# Altium schematic sheet Comparator.SchDoc
size 209 x 297 mm; SheetNumber: 3; SheetTotal: 4
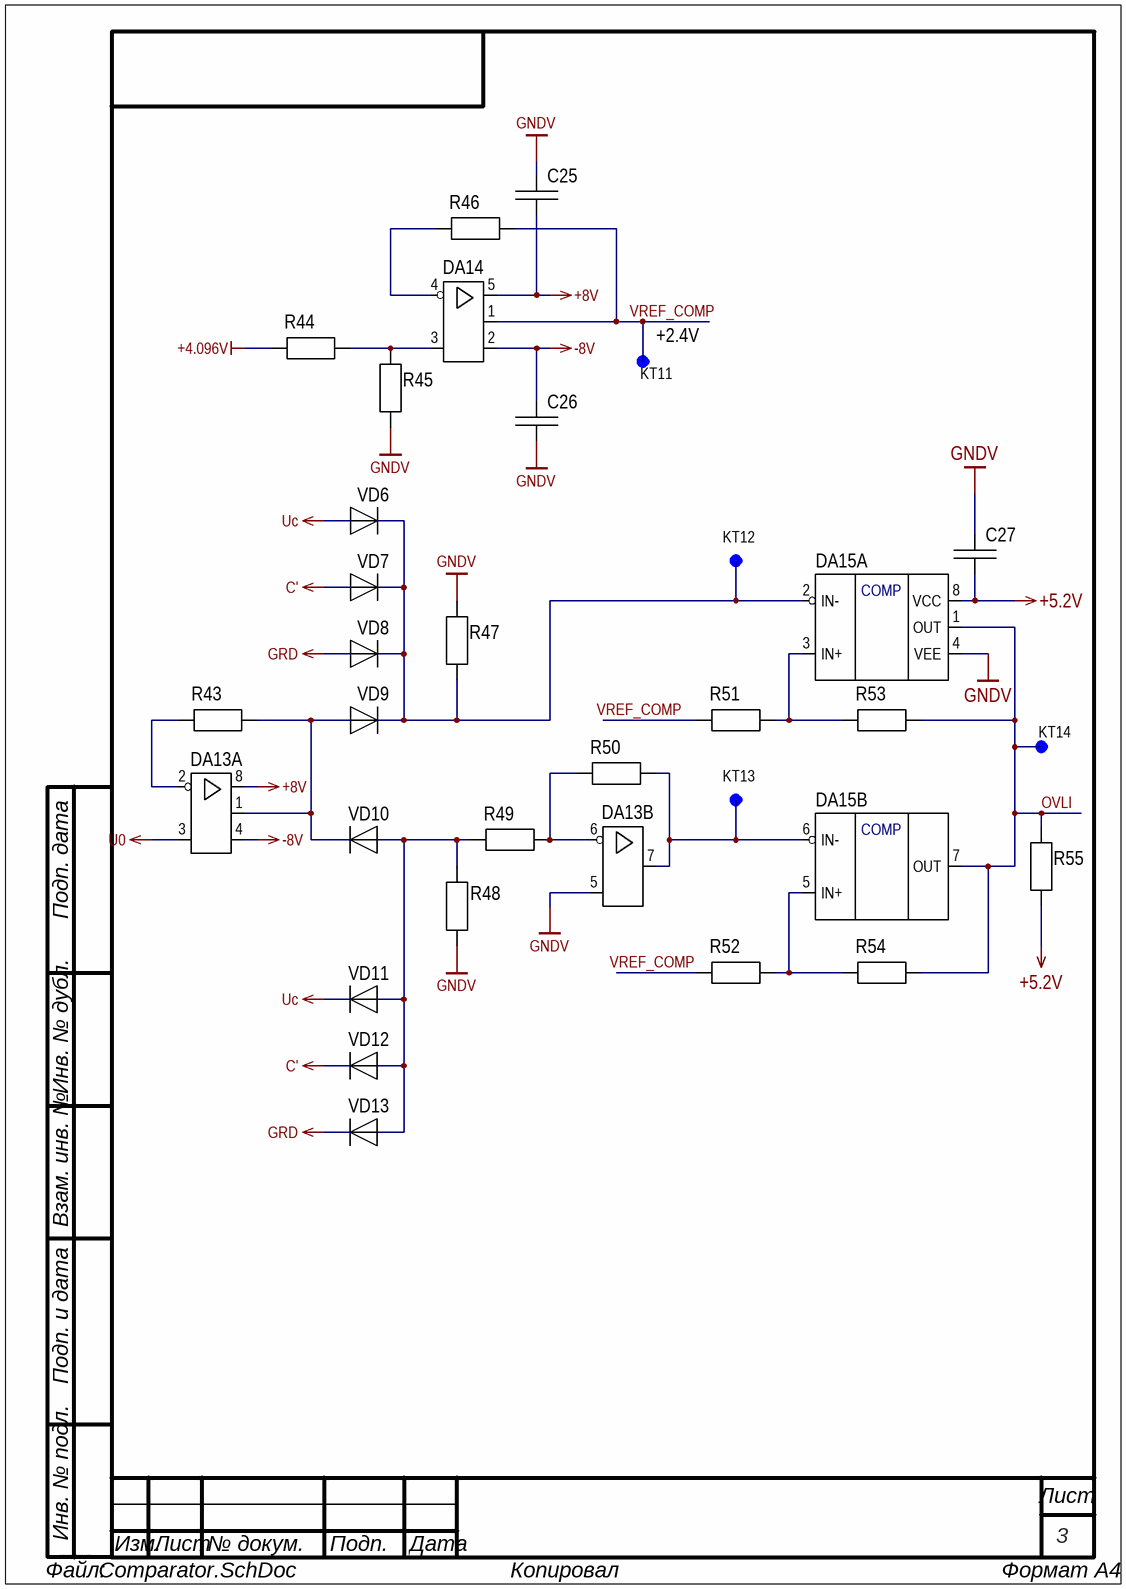
[diagram p0: Comparator.SchDoc]

## Parts
C25  1206-X7R-50 B-0,1 мкФ+-10%  [CAP: 1206]  (value not drawn)
C26  1206-X7R-50 B-0,1 мкФ+-10%  [CAP: 1206]  (value not drawn)
C27  1206-X7R-50 B-0,1 мкФ+-10%  [CAP: 1206]  (value not drawn)
DA13  TLV9152IDR  [8-SOIC]  (value not drawn)  (parts A,B of 2)
DA14  TLV9151IDR  [SOT-23-5]  (value not drawn)
DA15  TLV1842  [8-VSSOP]  (value not drawn)  (parts A,B of 2)
KT11  OTV10  [OTV10]  (value not drawn)  (no BOM)
KT12  OTV10  [OTV10]  (value not drawn)  (no BOM)
KT13  OTV10  [OTV10]  (value not drawn)  (no BOM)
KT14  OTV10  [OTV10]  (value not drawn)  (no BOM)
R43  1206-470 Ом+-5%  [1206]  (value not drawn)
R44  1206-7,15 кОм+-1%  [1206]  (value not drawn)
R45  1206-10 кОм+-0,5%  [1206]  (value not drawn)
R46  1206-470 Ом+-5%  [1206]  (value not drawn)
R47  1206-2,4 кОм+-5%  [1206]  (value not drawn)
R48  1206-2,4 кОм+-5%  [1206]  (value not drawn)
R49  0805-1 кОм+-0,1%  [0805]  (value not drawn)
R50  0805-1 кОм+-0,1%  [0805]  (value not drawn)
R51  0805-1 кОм+-0,1%  [0805]  (value not drawn)
R52  0805-1 кОм+-0,1%  [0805]  (value not drawn)
R53  1206-510 кОм+-1%  [1206]  (value not drawn)
R54  1206-510 кОм+-1%  [1206]  (value not drawn)
R55  1206-4,7 кОм+-5%  [1206]  (value not drawn)
VD6  1N4148WS  [SOD-323F]  (value not drawn)
VD7  1N4148WS  [SOD-323F]  (value not drawn)
VD8  1N4148WS  [SOD-323F]  (value not drawn)
VD9  1N4148WS  [SOD-323F]  (value not drawn)
VD10  1N4148WS  [SOD-323F]  (value not drawn)
VD11  1N4148WS  [SOD-323F]  (value not drawn)
VD12  1N4148WS  [SOD-323F]  (value not drawn)
VD13  1N4148WS  [SOD-323F]  (value not drawn)

## Nets
+4.096V: R44.2
+5.2V: C27.1 DA15.8(VCC) R55.1
+8V: C25.1 DA13.8(Vs+) DA14.5(Vs+)
-8V: C26.2 DA13.4(Vs-) DA14.2(Vs-)
C': VD7.2 VD12.1
GNDV: C25.2 C26.1 C27.2 DA13.5(+IN) DA15.4(VEE) R45.1 R47.2 R48.1
GRD: VD8.2 VD13.1
U0: DA13.3(+IN)
Uc: VD6.2 VD11.1
OVLI: DA15.1(OUT) DA15.7(OUT) KT14.1 R53.2 R54.2 R55.2
VREF_COMP: DA14.1(OUT) KT11.1 R46.2 R51.1 R52.2
NetDA13_1: DA13.1(OUT) R43.2 VD9.2 VD10.1
NetDA13_2: DA13.2(-IN) R43.1
NetDA13_6: DA13.6(-IN) R49.2 R50.1
NetDA13_7: DA13.7(OUT) DA15.6(IN-) KT13.1 R50.2
NetDA14_3: DA14.3(+IN) R44.1 R45.2
NetDA14_4: DA14.4(-IN) R46.1
NetDA15_2: DA15.2(IN-) KT12.1 R47.1 VD6.1 VD7.1 VD8.1 VD9.1
NetDA15_3: DA15.3(IN+) R51.2 R53.1
NetDA15_5: DA15.5(IN+) R52.1 R54.1
NetR48_2: R48.2 R49.1 VD10.2 VD11.2 VD12.2 VD13.2

## Notes on the sheet
- (near KT11) +2.4V
- Подп. дата
- Инв. № дубл.
- Взам. инв. №
- Подп. и дата
- Инв. № подл.
- Изм.
- Лист
- № докум.
- Подп.
- Дата
- Файл:
- ALTIUM GOSTBOM2.0 KEV
- Копировал
- Формат А4
- (in symbol TLV1842, part A) COMP
- (in symbol TLV1842, part B) COMP

## Library data of the parts
C25-C27 = 1206-X7R-50 B-0,1 мкФ+-10%: Value: 0,1 мкФ
DA15 = TLV1842: 40V, High-Speed Comparators; Value: *
R43 R46 = 1206-470 Ом+-5%: Value: 470 Ом; ModelPrint: 1206
R45 = 1206-10 кОм+-0,5%: Value: 10 кОм; ModelPrint: 1206
R47 R48 = 1206-2,4 кОм+-5%: Value: 2,4 кОм; ModelPrint: 1206
R49-R52 = 0805-1 кОм+-0,1%: Value: 1 кОм; ModelPrint: 0805
R53 R54 = 1206-510 кОм+-1%: Value: 510 кОм; ModelPrint: 1206
R55 = 1206-4,7 кОм+-5%: Value: 4,7 кОм; ModelPrint: 1206
VD6-VD13 = 1N4148WS: Small Signal Fast Switching Diod; Value: *
R44 = 1206-7,15 кОм+-1%: ModelPrint: 1206; Value: 7,15 кОм